# Altium schematic sheet Electrical Panel.SchDoc
size 420 x 297 mm
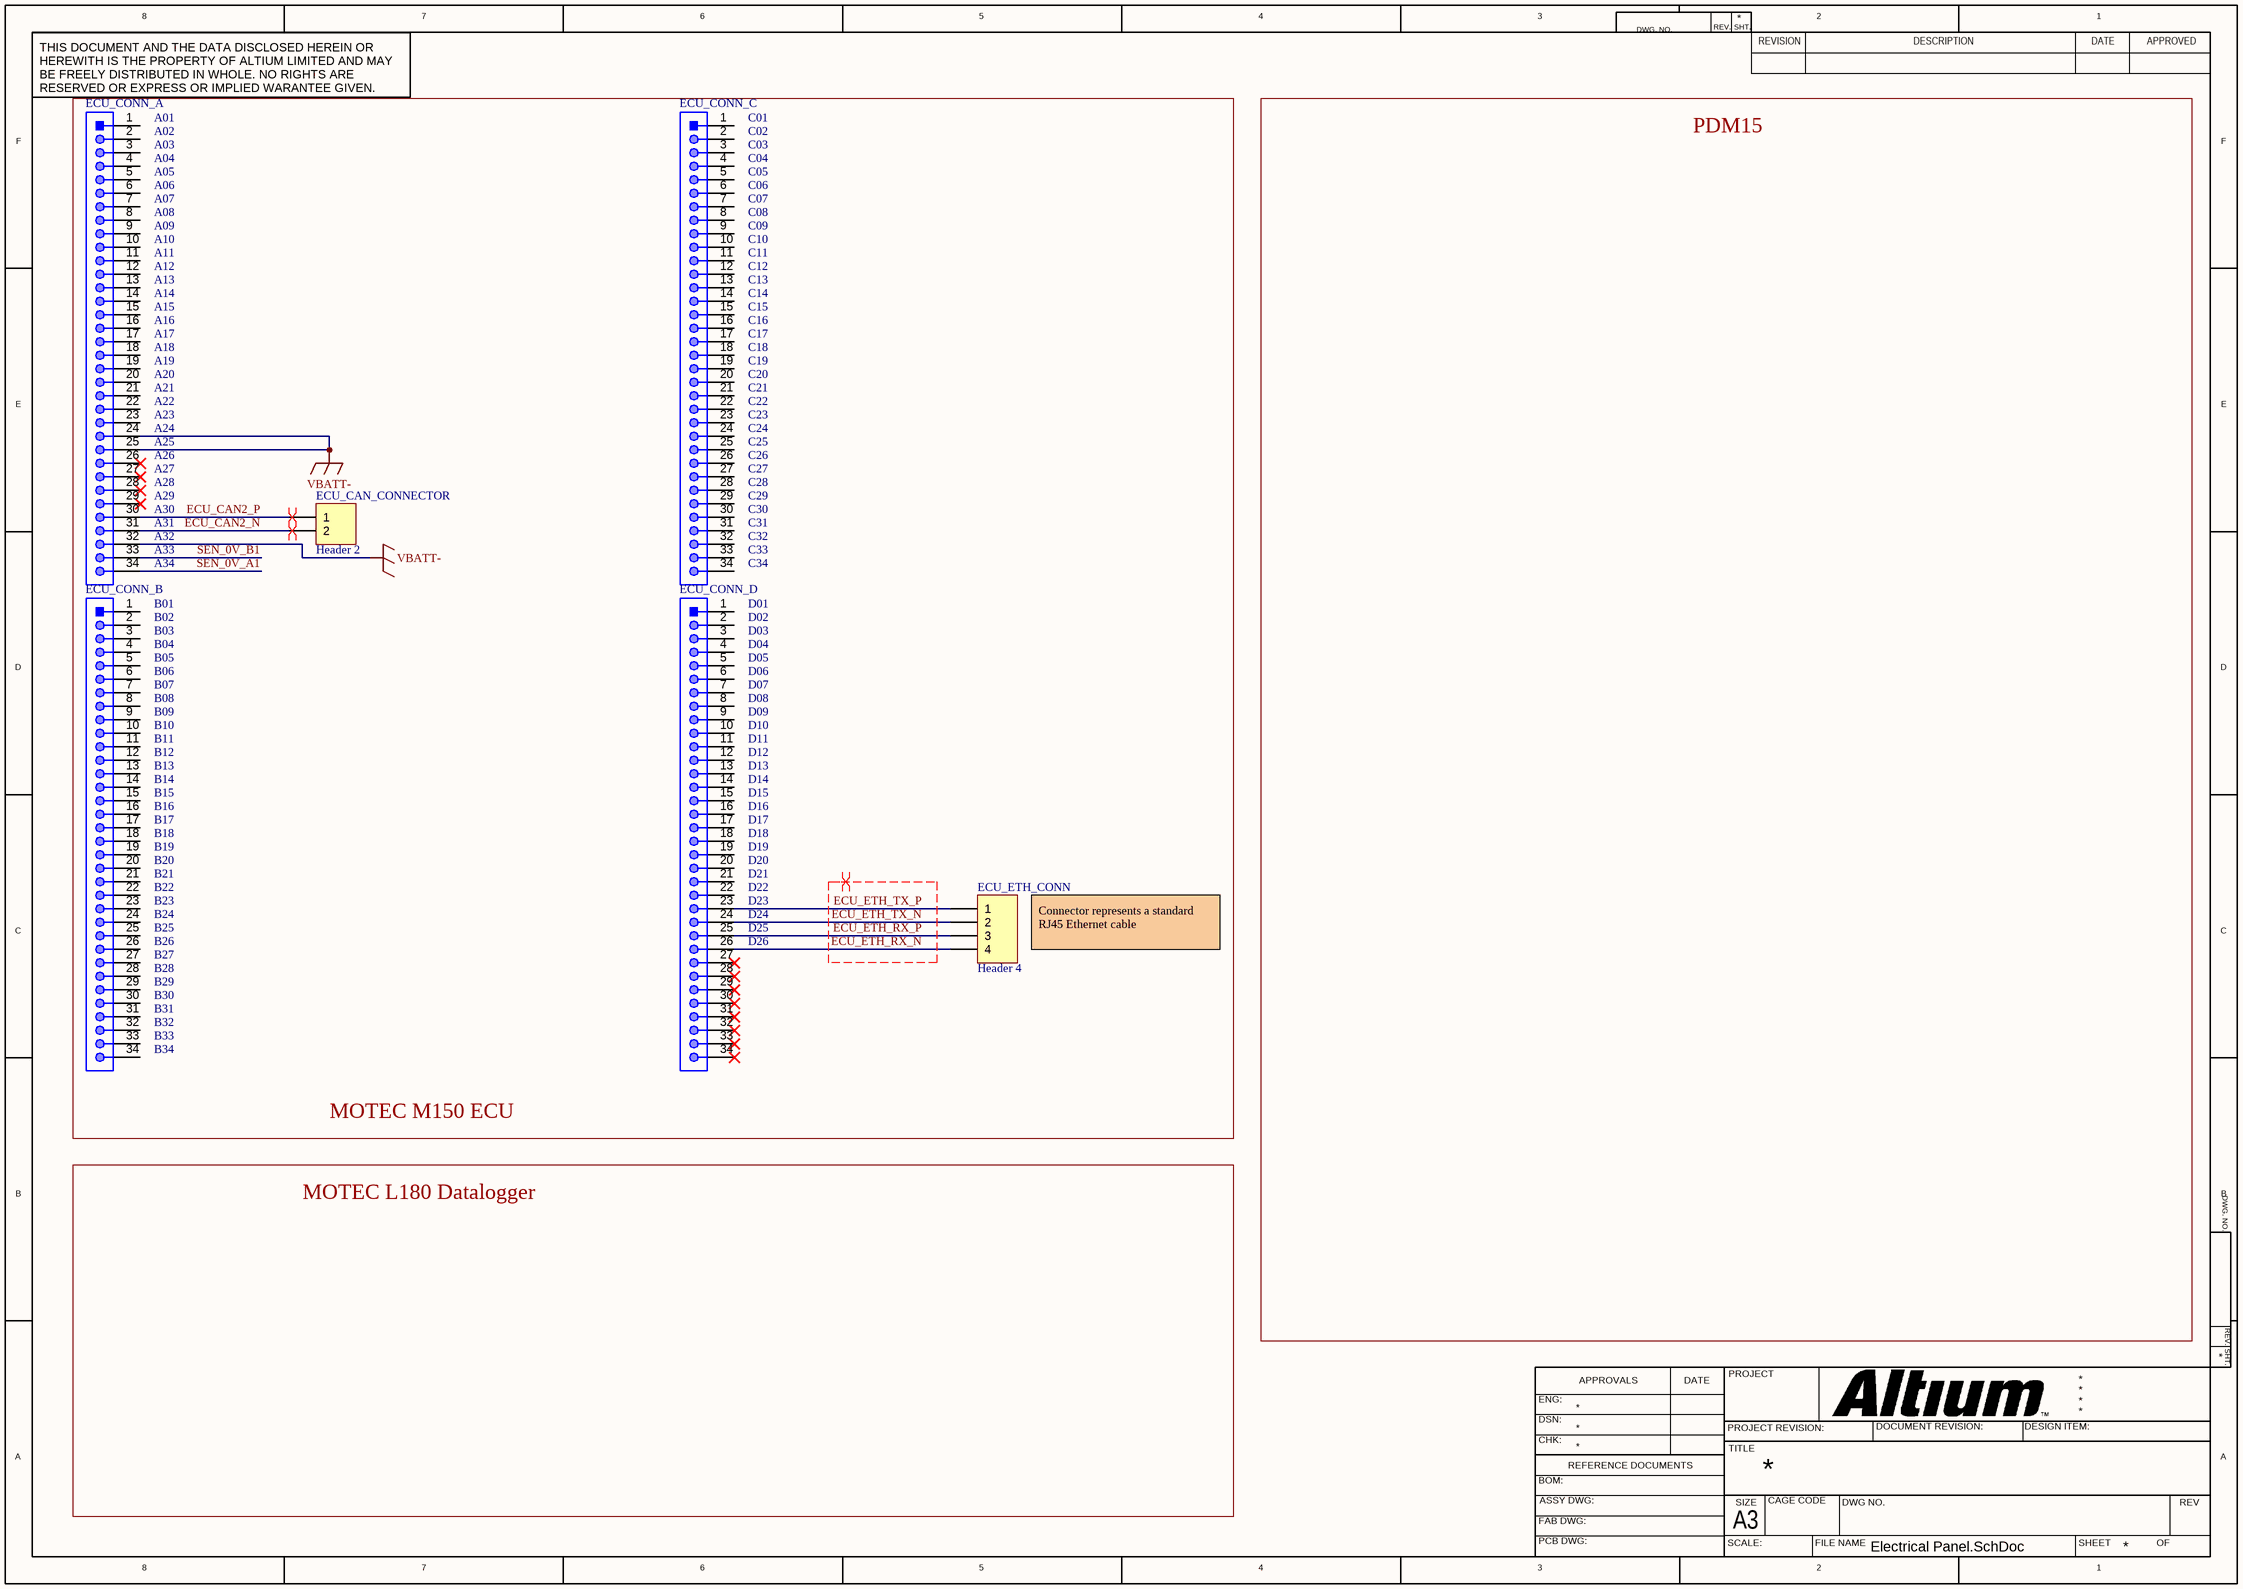
[diagram p0: Electrical Panel.SchDoc]

## Parts
ECU_CAN_CONNECTOR  Header 2  [HDR1X2]
ECU_CONN_A  61303411021  [61303411021]  (value not drawn)
ECU_CONN_B  61303411021  [61303411021]  (value not drawn)
ECU_CONN_C  61303411021  [61303411021]  (value not drawn)
ECU_CONN_D  61303411021  [61303411021]  (value not drawn)
ECU_ETH_CONN  Header 4  [HDR1X4]

## Nets
VBATT-: ECU_CONN_A.24 ECU_CONN_A.25 ECU_CONN_A.32
ECU_CAN2_N: ECU_CAN_CONNECTOR.2 ECU_CONN_A.31
ECU_CAN2_P: ECU_CAN_CONNECTOR.1 ECU_CONN_A.30
ECU_ETH_RX_N: ECU_CONN_D.26 ECU_ETH_CONN.4
ECU_ETH_RX_P: ECU_CONN_D.25 ECU_ETH_CONN.3
ECU_ETH_TX_N: ECU_CONN_D.24 ECU_ETH_CONN.2
ECU_ETH_TX_P: ECU_CONN_D.23 ECU_ETH_CONN.1
SEN_0V_A1: ECU_CONN_A.34
SEN_0V_B1: ECU_CONN_A.33

Not connected (* = marked no-connect by the designer): ECU_CONN_A 1 2 3 4 5 6 7 8 9 10 11 12 13 14 15 16 17 18 19 20 21 22 23 26* 27* 28* 29*; ECU_CONN_B 1 2 3 4 5 6 7 8 9 10 11 12 13 14 15 16 17 18 19 20 21 22 23 24 25 26 27 28 29 30 31 32 33 34; ECU_CONN_C 1 2 3 4 5 6 7 8 9 10 11 12 13 14 15 16 17 18 19 20 21 22 23 24 25 26 27 28 29 30 31 32 33 34; ECU_CONN_D 1 2 3 4 5 6 7 8 9 10 11 12 13 14 15 16 17 18 19 20 21 22 27* 28* 29* 30* 31* 32* 33* 34*

## Layout directives
differential pair: ECU_CAN2_N, ECU_CAN2_P, ECU_ETH_RX_N, ECU_ETH_RX_P, ECU_ETH_TX_N, ECU_ETH_TX_P

## Notes on the sheet
- (near ECU_CONN_A) A01
- (near ECU_CONN_C) C01
- (near ECU_CONN_A) A02
- (near ECU_CONN_A) A03
- (near ECU_CONN_A) A04
- (near ECU_CONN_A) A05
- (near ECU_CONN_A) A06
- (near ECU_CONN_C) C02
- (near ECU_CONN_C) C03
- (near ECU_CONN_C) C04
- (near ECU_CONN_C) C05
- (near ECU_CONN_C) C06
- PDM15
- (near ECU_CONN_A) A07
- (near ECU_CONN_A) A08
- (near ECU_CONN_A) A09
- (near ECU_CONN_A) A10
- (near ECU_CONN_A) A11
- (near ECU_CONN_C) C07
- (near ECU_CONN_C) C08
- (near ECU_CONN_C) C09
- (near ECU_CONN_C) C10
- (near ECU_CONN_C) C11
- (near ECU_CONN_A) A12
- (near ECU_CONN_A) A13
- (near ECU_CONN_A) A14
- (near ECU_CONN_A) A15
- (near ECU_CONN_A) A16
- (near ECU_CONN_C) C12
- (near ECU_CONN_C) C13
- (near ECU_CONN_C) C14
- (near ECU_CONN_C) C15
- (near ECU_CONN_C) C16
- (near ECU_CONN_A) A17
- (near ECU_CONN_A) A18
- (near ECU_CONN_A) A19
- (near ECU_CONN_A) A20
- (near ECU_CONN_A) A21
- (near ECU_CONN_C) C17
- (near ECU_CONN_C) C18
- (near ECU_CONN_C) C19
- (near ECU_CONN_C) C20
- (near ECU_CONN_C) C21
- (near ECU_CONN_A) A22
- (near ECU_CONN_A) A23
- (near ECU_CONN_A) A24
- (near ECU_CONN_A) A25
- (near ECU_CONN_A) A26
- (near ECU_CONN_C) C22
- (near ECU_CONN_C) C23
- (near ECU_CONN_C) C24
- (near ECU_CONN_C) C25
- (near ECU_CONN_C) C26
- (near ECU_CONN_A) A27
- (near ECU_CONN_A) A28
- (near ECU_CONN_A) A29
- (near ECU_CONN_A) A30
- (near ECU_CONN_A) A31
- (near ECU_CONN_C) C27
- (near ECU_CONN_C) C28
- (near ECU_CONN_C) C29
- (near ECU_CONN_C) C30
- (near ECU_CONN_C) C31
- (near ECU_CONN_A) A32
- (near ECU_CONN_A) A33
- A34
- (near ECU_CONN_C) C32
- (near ECU_CONN_C) C33
- C34
- B01
- B02
- (near ECU_CONN_B) B03
- (near ECU_CONN_B) B04
- (near ECU_CONN_B) B05
- D01
- D02
- (near ECU_CONN_D) D03
- (near ECU_CONN_D) D04
- (near ECU_CONN_D) D05
- (near ECU_CONN_B) B06
- (near ECU_CONN_B) B07
- (near ECU_CONN_B) B08
- (near ECU_CONN_B) B09
- (near ECU_CONN_B) B10
- (near ECU_CONN_D) D06
- (near ECU_CONN_D) D07
- (near ECU_CONN_D) D08
- (near ECU_CONN_D) D09
- (near ECU_CONN_D) D10
- (near ECU_CONN_B) B11
- (near ECU_CONN_B) B12
- (near ECU_CONN_B) B13
- (near ECU_CONN_B) B14
- (near ECU_CONN_B) B15
- (near ECU_CONN_D) D11
- (near ECU_CONN_D) D12
- (near ECU_CONN_D) D13
- (near ECU_CONN_D) D14
- (near ECU_CONN_D) D15
- (near ECU_CONN_B) B16
- (near ECU_CONN_B) B17
- (near ECU_CONN_B) B18
- (near ECU_CONN_B) B19
- (near ECU_CONN_B) B20
- (near ECU_CONN_D) D16
- (near ECU_CONN_D) D17
- (near ECU_CONN_D) D18
- (near ECU_CONN_D) D19
- (near ECU_CONN_D) D20
- (near ECU_CONN_B) B21
- (near ECU_CONN_B) B22
- (near ECU_CONN_B) B23
- (near ECU_CONN_B) B24
- (near ECU_CONN_B) B25
- (near ECU_CONN_D) D21
- (near ECU_CONN_D) D22
- (near ECU_CONN_D) D23
- (near ECU_CONN_D) D24
- (near ECU_CONN_D) D25
- (near ECU_CONN_B) B26
- (near ECU_CONN_B) B27
- (near ECU_CONN_B) B28
- (near ECU_CONN_B) B29
- (near ECU_CONN_B) B30
- (near ECU_CONN_D) D26
- Connector represents a standard RJ45 Ethernet cable
- (near ECU_CONN_B) B31
- (near ECU_CONN_B) B32
- (near ECU_CONN_B) B33
- (near ECU_CONN_B) B34
- MOTEC M150 ECU
- MOTEC L180 Datalogger
- 8
- 7
- 6
- 5
- 4
- 3
- DWG. NO.
- REV.
- SHT.
- REVISION
- 2
- DESCRIPTION
- DATE
- 1
- APPROVED
- THIS DOCUMENT AND THE DATA DISCLOSED HEREIN OR HEREWITH IS THE PROPERTY OF ALTIUM LIMITED AND MAY BE FREELY DISTRIBUTED IN WHOLE. NO RIGHTS ARE RESERVED OR EXPRESS OR IMPLIED WARANTEE GIVEN.
- F
- E
- D
- C
- B
- ENG:
- APPROVALS
- PROJECT
- A
- DSN:
- CHK:
- REFERENCE DOCUMENTS
- PROJECT REVISION:
- TITLE
- DOCUMENT REVISION:
- DESIGN ITEM:
- BOM:
- FAB DWG:
- PCB DWG:
- ASSY DWG:
- SCALE:
- A3
- SIZE
- CAGE CODE
- FILE NAME
- DWG NO.
- SHEET
- OF
- REV

## Library data of the parts
ECU_CAN_CONNECTOR = Header 2: Header, 2-Pin; LatestRevisionDate: 17-Jul-2002; LatestRevisionNote: Re-released for DXP Platform.; Publisher: Altium Limited
ECU_CONN_A ECU_CONN_B ECU_CONN_C ECU_CONN_D = CMP-1502-01125-1: THT Angled Pin Header WR-PHD, Pitch 2.54 mm, Single Row, 34 pins; Manufacturer: Wurth Elektronik; Withstanding Voltage: 500VAC; Pin Number: 34; Rated Current: 3A; Gender: Male; Pitch: 2.54mm; Working Voltage: 250VAC; Contact Resistance: 20mOhm; Orientation: Angled; Mounting Technology: THT; Package Reference: 61303411021; Part Number: 61303411021; Datasheet URL: https://katalog.we-online.de/em/datasheet/6130xx11021.pdf; Publisher: WurthElektronik; Row Number: Single; Operating Temperature: -40to105degC; Packaging: Bag; Manufacturer URL: http://www.we-online.de
ECU_ETH_CONN = Header 4: Header, 4-Pin; LatestRevisionDate: 17-Jul-2002; LatestRevisionNote: Re-released for DXP Platform.; Publisher: Altium Limited